# EAGLE design atmega328 (EAGLE 7.3.0)
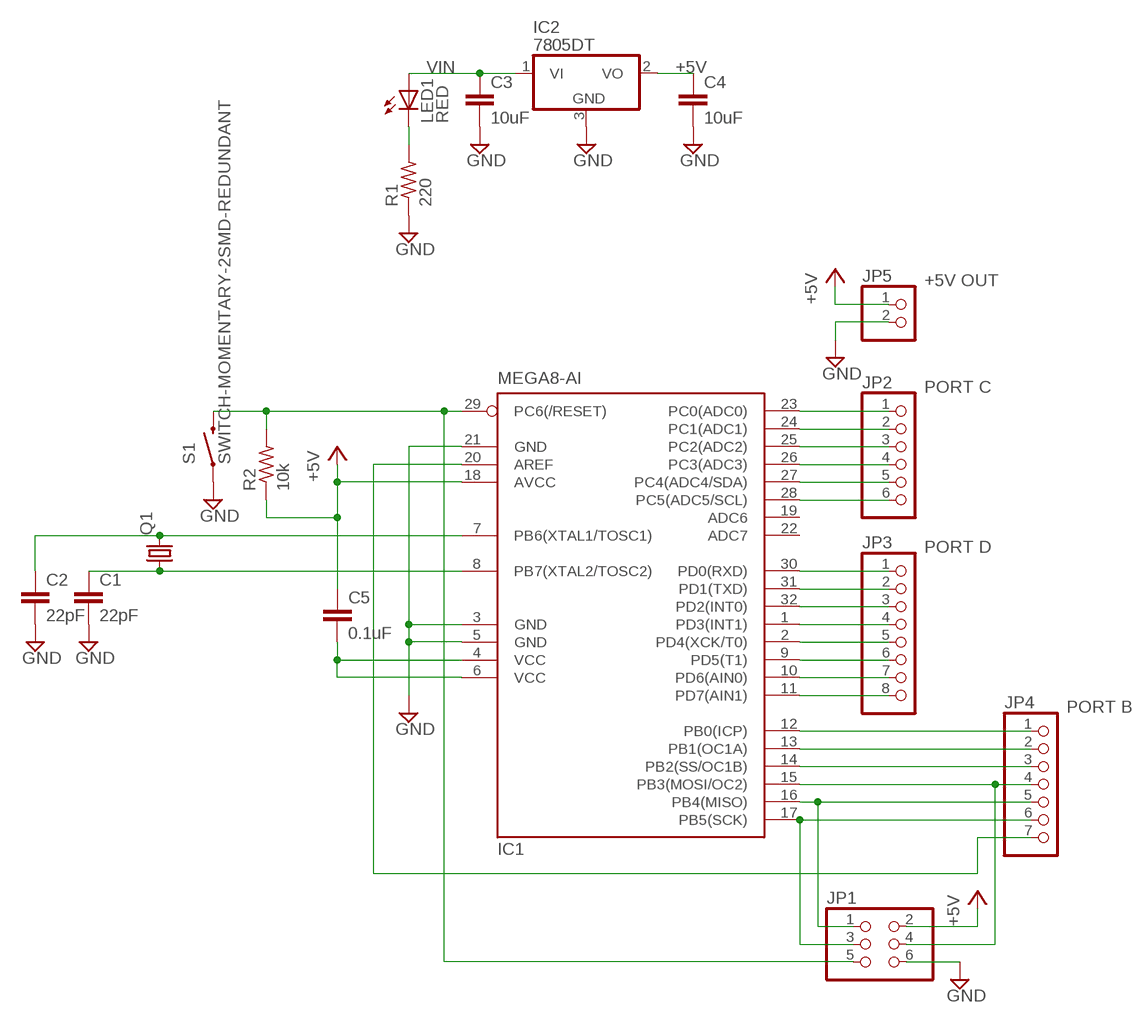
[diagram p0: schematic, sheet 1]

## Parts
C1  22pF  C-EUC0805  [C0805]
C2  22pF  C-EUC0805  [C0805]
C3  10uF  C-EUC0805  [C0805]
C4  10uF  C-EUC0805  [C0805]
C5  0.1uF  C-EUC0805  [C0805]
IC1  MEGA8-AI  [TQFP32-08]
IC2  7805DT  [TO252]
JP1  PINHD-2X3  [2X03]
JP2  PINHD-1X6  [1X06]
JP3  PINHD-1X8  [1X08]
JP4  PINHD-1X7  [1X07]
JP5  PINHD-1X2  [1X02]
LED1  RED  LEDCHIPLED_0805  [CHIPLED_0805]
Q1  CRYSTALHC49UP  [HC49UP]
R1  220  R-US_R0805  [R0805]
R2  10k  R-US_R0805  [R0805]
S1  SWITCH-MOMENTARY-2SMD-REDUNDANT  [TACTILE-SWITCH-SMD]

## Nets
+5V: C4.1 C5.1 IC1.18(AVCC) IC2.2(VO) JP1.2 JP5.1 R2.1
GND: C1.2 C2.2 C3.2 C4.2 IC1.3(GND) IC1.5(GND) IC1.21(GND) IC2.3(GND) JP1.6 JP5.2 R1.1 S1.1 S1.2
N$1: C2.1 IC1.7(PB6(XTAL1/TOSC1)) Q1.2
N$2: LED1.C R1.2
N$3: C1.1 IC1.8(PB7(XTAL2/TOSC2)) Q1.1
N$4: IC1.29(PC6(/RESET)) JP1.5 R2.2 S1.3 S1.4
N$5: IC1.23(PC0(ADC0)) JP2.1
N$6: IC1.24(PC1(ADC1)) JP2.2
N$7: IC1.25(PC2(ADC2)) JP2.3
N$8: IC1.26(PC3(ADC3)) JP2.4
N$9: IC1.27(PC4(ADC4/SDA)) JP2.5
N$10: IC1.28(PC5(ADC5/SCL)) JP2.6
N$11: IC1.30(PD0(RXD)) JP3.1
N$12: IC1.31(PD1(TXD)) JP3.2
N$13: IC1.32(PD2(INT0)) JP3.3
N$14: IC1.1(PD3(INT1)) JP3.4
N$15: IC1.2(PD4(XCK/T0)) JP3.5
N$16: IC1.9(PD5(T1)) JP3.6
N$17: IC1.10(PD6(AIN0)) JP3.7
N$18: IC1.11(PD7(AIN1)) JP3.8
N$19: IC1.12(PB0(ICP)) JP4.1
N$20: IC1.13(PB1(OC1A)) JP4.2
N$21: IC1.14(PB2(SS/OC1B)) JP4.3
N$22: IC1.15(PB3(MOSI/OC2)) JP1.4 JP4.4
N$23: IC1.16(PB4(MISO)) JP1.1 JP4.5
N$24: IC1.17(PB5(SCK)) JP1.3 JP4.6
N$25: IC1.20(AREF) JP4.7
N$26: C5.2 IC1.4(VCC) IC1.6(VCC)
VIN: C3.1 IC2.1(VI) LED1.A
Unconnected: IC1.19(ADC6) IC1.22(ADC7)

## Notes on the sheet
- +5V OUT
- PORT C
- PORT D
- PORT B

## Library data of the parts
C1-C5 = resistor:C-EU: CAPACITOR, European symbol
IC1 = atmel:MEGA8: MICROCONTROLLER 8 Kbytes FLASH, 1 kbytes SRAM, 512 bytes EEPROM, USART, 6-channel 10 bit ADC, 2-channel 8 bit ADC Pin compatible with Atmega48, ATMega88, ATMega168 Source: avr.lbr; MPN: ATMEGA8-16AU; OC_FARNELL: 9171371; OC_NEWARK: 73M8863
IC2 = linear:78*: Positive VOLTAGE REGULATOR Source: http://cache.national.com/ds/LM/LM78L05.pdf http://www.fairchildsemi.com/ds/LM/LM7805.pdf
JP1 = pinhead:PINHD-2X3: PIN HEADER
JP2 = pinhead:PINHD-1X6: PIN HEADER
JP3 = pinhead:PINHD-1X8: PIN HEADER
JP4 = pinhead:PINHD-1X7: PIN HEADER
JP5 = pinhead:PINHD-1X2: PIN HEADER
LED1 = led:LED: LED OSRAM: - CHIPLED LG R971, LG N971, LY N971, LG Q971, LY Q971, LO R971, LY R971 LH N974, LH R974 LS Q976, LO Q976, LY Q976 LO Q996 - Hyper CHIPLED LW Q18S LB Q993, LB Q99A, LB R99A - SideLED LS A670, LO A670, LY A670, LG A670, LP A670 LB A673, LV A673, LT A673, LW A673 LH A674 LY A675 LS A676, LA A676, LO A676, LY A676, LW A676 LS A679, LY A679, LG A679 - Hyper Micro SIDELED® LS Y876, LA Y876, LO Y876, LY Y876 LT Y87S - SmartLED LW L88C, LW L88S LB L89C, LB L89S, LG L890 LS L89K, LO L89K, LY L89K LS L896, LA L896, LO L896, LY L896 - TOPLED LS T670, LO T670, LY T670, LG T670, LP T670 LSG T670, LSP T670, LSY T670, LOP T670, LYG T670 LG T671, LOG T671, LSG T671 LB T673, LV T673, LT T673, LW T673 LH T674 LS T676, LA T676, LO T676, LY T676, LB T676, LH T676, LSB T676, LW T676 LB T67C, LV T67C, LT T67C, LS T67K, LO T67K, LY T67K, LW E67C LS E67B, LA E67B, LO E67B, LY E67B, LB E67C, LV E67C, LT E67C LW T67C LS T679, LY T679, LG T679 LS T770, LO T770, LY T770, LG T770, LP T770 LB T773, LV T773, LT T773, LW T773 LH T774 LS E675, LA E675, LY E675, LS T675 LS T776, LA T776, LO T776, LY T776, LB T776 LHGB T686 LT T68C, LB T68C - Hyper Mini TOPLED® LB M676 - Mini TOPLED Santana® LG M470 LS M47K, LO M47K, LY M47K Source: http://www.osram.convergy.de LUXEON: - LUMILED® LXK2-PW12-R00, LXK2-PW12-S00, LXK2-PW14-U00, LXK2-PW14-V00 LXK2-PM12-R00, LXK2-PM12-S00, LXK2-PM14-U00 LXK2-PE12-Q00, LXK2-PE12-R00, LXK2-PE12-S00, LXK2-PE14-T00, LXK2-PE14-U00 LXK2-PB12-K00, LXK2-PB12-L00, LXK2-PB12-M00, LXK2-PB14-N00, LXK2-PB14-P00, LXK2-PB14-Q00 LXK2-PR12-L00, LXK2-PR12-M00, LXK2-PR14-Q00, LXK2-PR14-R00 LXK2-PD12-Q00, LXK2-PD12-R00, LXK2-PD12-S00 LXK2-PH12-R00, LXK2-PH12-S00 LXK2-PL12-P00, LXK2-PL12-Q00, LXK2-PL12-R00 Source: www.luxeon.com KINGBRIGHT: KA-3528ASYC Source: www.kingbright.com
Q1 = crystal:CRYSTAL: CRYSTAL; OC_FARNELL: unknown; OC_NEWARK: unknown
R1 R2 = resistor:R-US_: RESISTOR, American symbol
S1 = SparkFun-Electromechanical:SWITCH-MOMENTARY-2: Various NO switches- pushbuttons, reed, etc; PROD_ID: SWCH-08247

## Board
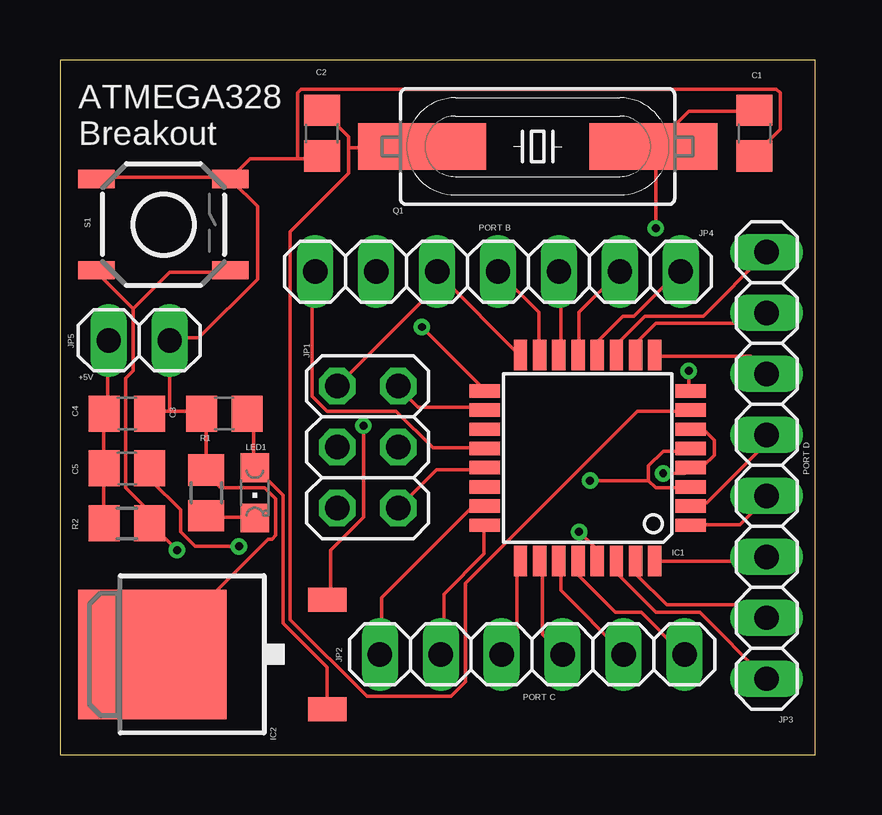
[diagram p1: board, top side]
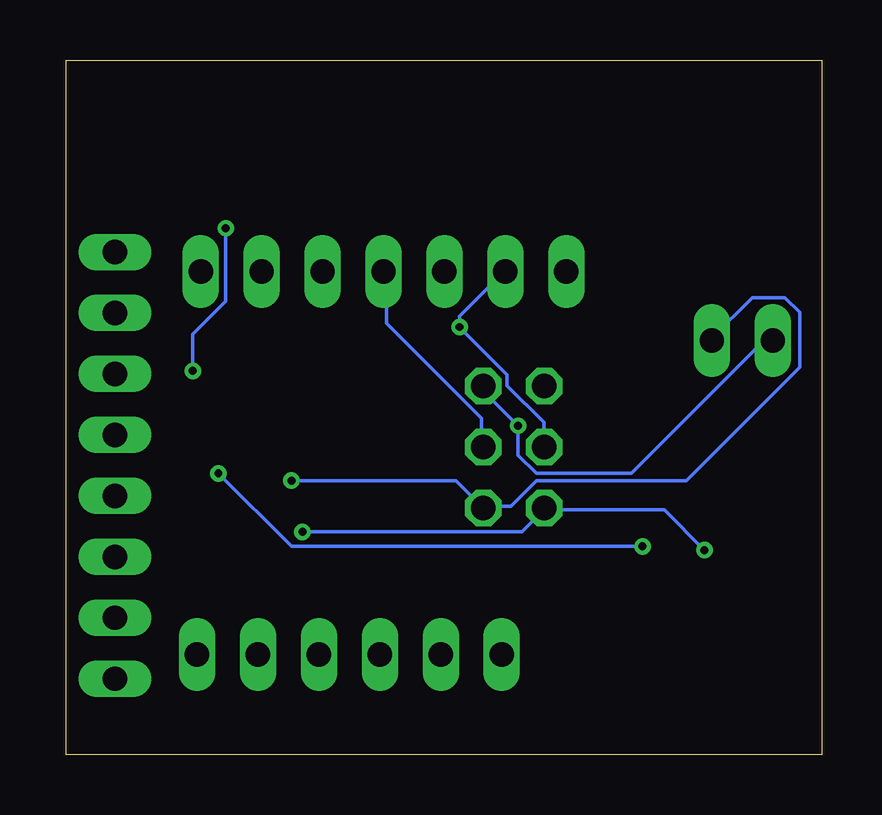
[diagram p2: board, bottom side, seen from below]

Size 31.5 x 28.96 mm. Coordinates in mm from the lower left corner, seen from the top.
Outline: 0,0 31.5,0 31.5,28.96 0,28.96 0,0
Copper layers (1*16): Top 0.0356mm / dielectric 1.5011mm / Bottom 0.0356mm
Design rules "osh": minimum track width 6mil, minimum drill 13mil, track to track 6mil, track to pad 6mil, pad to pad 6mil, via to via 6mil, smd to smd 6mil, copper to edge 15mil, drill to drill 6mil, minimum pad ring 7mil, minimum via ring 7mil, stop-mask expansion 3mil, vias tented up to drill 0mil, thermal gap 10mil

### Footprints (pad centres in the part's own frame; a part is rotated, then mirrored left to right if it is on the bottom)
C0805 = smd 1.3 x 1.5: 1 -0.95,0; 2 0.95,0
TQFP32-08 = smd 1.27 x 0.559: 1 -4.293,2.8; 2 -4.293,2; 3 -4.293,1.2; 4 -4.293,0.4; 5 -4.293,-0.4; 6 -4.293,-1.2; 7 -4.293,-2; 8 -4.293,-2.8; 17 4.293,-2.8; 18 4.293,-2; 19 4.293,-1.2; 20 4.293,-0.4; 21 4.293,0.4; 22 4.293,1.2; 23 4.293,2; 24 4.293,2.8 | smd 0.559 x 1.27: 9 -2.8,-4.293; 10 -2,-4.293; 11 -1.2,-4.293; 12 -0.4,-4.293; 13 0.4,-4.293; 14 1.2,-4.293; 15 2,-4.293; 16 2.8,-4.293; 25 2.8,4.293; 26 2,4.293; 27 1.2,4.293; 28 0.4,4.293; 29 -0.4,4.293; 30 -1.2,4.293; 31 -2,4.293; 32 -2.8,4.293
TO252 = smd 1 x 1.6: 1 -2.28,-4.8; 2 2.28,-4.8 | smd 5.4 x 6.2: 3 0,2.5
2X03 = drill 1.016 octagon: 1 -2.54,-1.27; 2 -2.54,1.27; 3 0,-1.27; 4 0,1.27; 5 2.54,-1.27; 6 2.54,1.27
1X06 = drill 1.016 long: 1 -6.35,0; 2 -3.81,0; 3 -1.27,0; 4 1.27,0; 5 3.81,0; 6 6.35,0
1X08 = drill 1.016 long: 1 -8.89,0; 2 -6.35,0; 3 -3.81,0; 4 -1.27,0; 5 1.27,0; 6 3.81,0; 7 6.35,0; 8 8.89,0
1X07 = drill 1.016 long: 1 -7.62,0; 2 -5.08,0; 3 -2.54,0; 4 0,0; 5 2.54,0; 6 5.08,0; 7 7.62,0
1X02 = drill 1.016 long: 1 -1.27,0; 2 1.27,0
CHIPLED_0805 = smd 1.2 x 1.2: A 0,-1.05; C 0,1.05
HC49UP = smd 5.334 x 1.93: 1 -4.826,0; 2 4.826,0
R0805 = smd 1.3 x 1.5: 1 -0.95,0; 2 0.95,0
TACTILE-SWITCH-SMD = smd 1.524 x 0.762: 1 -2.794,1.905; 2 2.794,1.905; 3 -2.794,-1.905; 4 2.794,-1.905

### Placement (x,y rotation side)
C1  28.96,25.91 270 top
C2  10.92,25.91 270 top
C3  6.86,14.22 180 top
C4  2.79,14.22 0 top
C5  2.79,11.94 0 top
IC1  22,12.37 180 top
IC2  6.35,4.19 90 top
JP1  12.83,12.83 270 top
JP2  19.68,4.19 0 top
JP3  29.46,12.06 90 top
JP4  18.26,20.14 180 top
JP5  3.3,17.27 0 top
LED1  8.13,10.92 180 top
Q1  19.91,25.35 180 top
R1  6.1,10.92 270 top
R2  2.79,9.65 0 top
S1  4.32,22.1 0 top

### Tracks (layer width: path | path; a pad name or v marks a point on that pad's centre or on a via)
+5V  (via drill 0.33)
  Top 0.152: R2.1 1.83,9.75 1.83,11.89 C5.1 1.83,12.04 1.83,14.17 C4.1 1.98,14.33 1.98,17.22 JP5.1 | IC1.18 17.68,14.48 14.94,14.48 14.17,15.24 JP1.2 | v12.65,13.72 12.65,9.91 11.28,8.53 11.28,6.55 IC2.2
  Bottom 0.152: JP1.2 14.17,15.24 v12.65,13.72 12.65,12.5 11.89,11.73 7.92,11.73 2.44,17.22 2.13,17.22 JP5.1
GND  (via drill 0.33)
  Top 0.152: 24.54,11.43 24.84,11.12 26.21,11.12 IC1.3 | 24.54,11.43 24.54,12.04 25.15,12.65 26.21,12.65 IC1.5 | JP1.6 15.7,11.89 17.68,11.89 IC1.21 | v22.1,11.43 24.54,11.43 | 4.57,14.33 5.79,14.33 C3.2 5.94,14.17 6.1,14.02 R1.1 6.1,11.73 6.71,11.12 8.53,11.12 8.99,10.67 8.99,9.14 8.84,8.99 8.69,8.99 3.96,4.27 IC2.3 | 4.57,14.33 3.81,14.33 C4.2 | 4.57,14.33 JP5.2 4.57,17.37 5.79,17.37 8.23,19.81 8.23,22.86 7.16,23.93 S1.2 | 9.91,24.84 7.92,24.84 7.16,24.08 S1.2 | 9.91,24.84 10.82,24.84 C2.2 | 9.91,24.84 9.91,27.58 10.06,27.74 29.87,27.74 30.02,27.58 30.02,26.06 28.96,24.99 C1.2 | S1.1 1.52,24.08 7.01,24.08 S1.2
  Bottom 0.152: v22.1,11.43 15.24,11.43 JP1.6 14.02,10.36 12.95,10.36 11.89,11.43 5.64,11.43 0.91,16.15 0.91,18.44 1.52,19.05 2.9,19.05 4.57,17.37 JP5.2
N$1
  Top 0.152: 12.04,25.3 12.04,25.76 10.97,26.82 C2.1 | 12.04,25.3 12.04,24.23 9.6,21.79 9.6,5.64 12.8,2.44 16.31,2.44 16.92,3.05 16.92,7.16 24.08,14.33 26.21,14.33 IC1.7 | 12.04,25.3 15.09,25.3 Q1.2
N$2
  Top 0.152: LED1.C 8.08,9.91 6.1,9.91 R1.2
N$3  (via drill 0.33)
  Top 0.152: v26.21,16 26.21,15.24 IC1.8 | v24.84,21.95 24.84,25.3 Q1.1 26.21,26.82 28.96,26.82 C1.1
  Bottom 0.152: v26.21,16 26.21,17.53 24.84,18.9 v24.84,21.95
N$4  (via drill 0.33)
  Top 0.152: v21.64,9.3 22.25,8.69 22.25,8.08 IC1.29 | 3.05,18.59 3.05,16 2.74,15.7 2.74,11.12 3.66,10.21 3.66,9.75 R2.2 3.81,9.6 v4.88,8.53 | 3.05,18.59 1.52,20.12 S1.3 | 3.05,18.59 4.57,20.12 7.01,20.12 S1.4
  Bottom 0.152: v21.64,9.3 12.5,9.3 11.58,10.21 JP1.5 11.43,10.21 6.55,10.21 v4.88,8.53
N$5
  Top 0.152: IC1.23 17.68,10.36 17.22,10.36 13.41,6.55 13.41,4.27 JP2.1
N$6
  Top 0.152: IC1.24 17.68,9.45 17.68,8.38 16,6.71 16,4.27 JP2.2
N$7
  Top 0.152: IC1.25 19.05,8.08 19.05,4.88 18.44,4.27 JP2.3
N$8
  Top 0.152: JP2.4 20.12,5.03 20.12,8.08 IC1.26
N$9
  Top 0.152: IC1.27 20.88,8.08 20.88,6.86 23.47,4.27 JP2.5
N$10
  Top 0.152: IC1.28 21.64,8.08 21.64,7.47 23.16,5.94 24.23,5.94 25.91,4.27 JP2.6
N$11
  Top 0.152: IC1.30 23.32,8.08 23.32,7.47 24.84,5.94 26.67,5.94 29.41,3.2 JP3.1
N$12
  Top 0.152: IC1.31 24.08,8.08 24.08,7.47 25.3,6.25 28.96,6.25 29.41,5.79 JP3.2
N$13
  Top 0.152: IC1.32 29.26,8.08 29.41,8.23 JP3.3
N$14
  Top 0.152: IC1.1 26.36,9.6 28.35,9.6 29.41,10.67 JP3.4
N$15
  Top 0.152: IC1.2 26.36,10.52 26.98,10.52 29.41,12.95 29.41,13.26 JP3.5
N$16
  Top 0.152: IC1.9 24.84,16.61 28.8,16.61 29.41,16 JP3.6
N$17
  Top 0.152: IC1.10 24.08,16.76 24.08,17.22 24.84,17.98 29.11,17.98 29.41,18.29 JP3.7
N$18
  Top 0.152: IC1.11 23.32,16.76 23.32,17.22 24.38,18.29 26.82,18.29 29.41,20.88 JP3.8
N$19
  Top 0.152: IC1.12 22.4,16.76 22.4,17.22 23.47,18.29 23.93,18.29 25.76,20.12 JP4.1
N$20
  Top 0.152: JP4.2 21.64,18.44 21.64,16.76 IC1.13
N$21
  Top 0.152: IC1.14 20.88,16.76 20.88,20.12 JP4.3
N$22
  Top 0.152: JP4.4 19.96,18.44 19.96,16.76 IC1.15
  Bottom 0.152: JP1.4 14.17,12.95 14.17,14.02 18.14,17.98 18.14,20.12 JP4.4
N$23
  Top 0.152: 16,19.81 15.7,20.12 JP4.5 16,19.81 | 16,19.81 19.05,16.76 IC1.16 | 16,19.81 JP1.1
N$24  (via drill 0.33)
  Top 0.152: v15.09,17.83 17.68,15.24 IC1.17
  Bottom 0.152: JP4.6 13.26,20.12 15.09,18.29 v15.09,17.83 13.11,15.85 13.11,15.39 11.58,13.87 11.58,12.95 JP1.3
N$25
  Top 0.152: IC1.20 17.68,12.8 15.54,12.8 14.02,14.33 11.12,14.33 10.52,14.94 10.52,20.12 JP4.7
N$26  (via drill 0.33)
  Top 0.152: IC1.6 26.36,13.56 26.82,13.56 27.28,13.11 27.28,12.5 26.82,12.04 26.36,12.04 IC1.4 26.21,11.89 26.06,11.73 v25.15,11.73 | v7.47,8.69 5.64,8.69 5.03,9.3 5.03,10.21 3.81,11.43 3.81,11.89 C5.2
  Bottom 0.152: v7.47,8.69 22.1,8.69 v25.15,11.73
VIN
  Top 0.152: C3.1 7.92,14.17 8.08,14.02 8.08,12.04 LED1.A 8.23,11.89 9.3,10.82 9.3,5.49 11.12,3.66 11.12,1.98 IC2.1

### Text on the board
tPlace: ATMEGA328 / Breakout
tNames: PORT B | +5V | PORT D | PORT C